# EAGLE design baseboard_v1 (EAGLE 9.5.1)
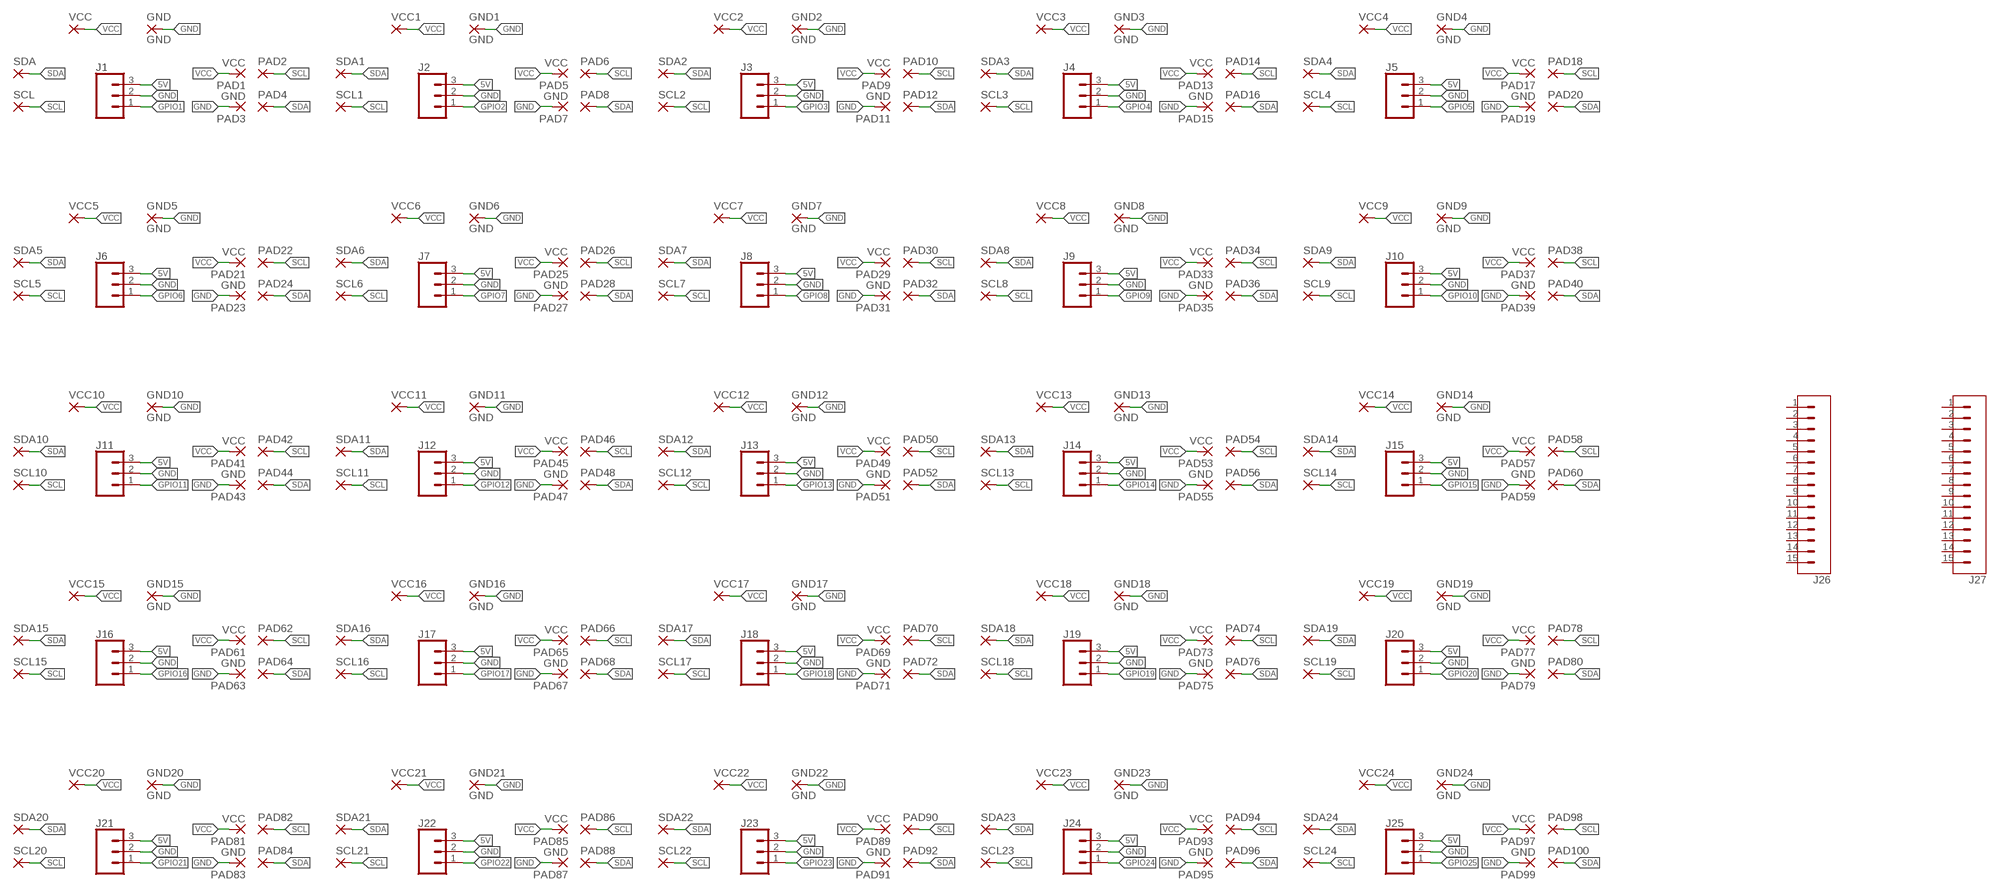
[diagram p0: schematic, sheet 1]

## Parts
GND  GND  2,15/1,0  [2,15/1,0]
GND1  GND  2,15/1,0  [2,15/1,0]
GND2  GND  2,15/1,0  [2,15/1,0]
GND3  GND  2,15/1,0  [2,15/1,0]
GND4  GND  2,15/1,0  [2,15/1,0]
GND5  GND  2,15/1,0  [2,15/1,0]
GND6  GND  2,15/1,0  [2,15/1,0]
GND7  GND  2,15/1,0  [2,15/1,0]
GND8  GND  2,15/1,0  [2,15/1,0]
GND9  GND  2,15/1,0  [2,15/1,0]
GND10  GND  2,15/1,0  [2,15/1,0]
GND11  GND  2,15/1,0  [2,15/1,0]
GND12  GND  2,15/1,0  [2,15/1,0]
GND13  GND  2,15/1,0  [2,15/1,0]
GND14  GND  2,15/1,0  [2,15/1,0]
GND15  GND  2,15/1,0  [2,15/1,0]
GND16  GND  2,15/1,0  [2,15/1,0]
GND17  GND  2,15/1,0  [2,15/1,0]
GND18  GND  2,15/1,0  [2,15/1,0]
GND19  GND  2,15/1,0  [2,15/1,0]
GND20  GND  2,15/1,0  [2,15/1,0]
GND21  GND  2,15/1,0  [2,15/1,0]
GND22  GND  2,15/1,0  [2,15/1,0]
GND23  GND  2,15/1,0  [2,15/1,0]
GND24  GND  2,15/1,0  [2,15/1,0]
J1  CONN_03  [1X03]
J2  CONN_03  [1X03]
J3  CONN_03  [1X03]
J4  CONN_03  [1X03]
J5  CONN_03  [1X03]
J6  CONN_03  [1X03]
J7  CONN_03  [1X03]
J8  CONN_03  [1X03]
J9  CONN_03  [1X03]
J10  CONN_03  [1X03]
J11  CONN_03  [1X03]
J12  CONN_03  [1X03]
J13  CONN_03  [1X03]
J14  CONN_03  [1X03]
J15  CONN_03  [1X03]
J16  CONN_03  [1X03]
J17  CONN_03  [1X03]
J18  CONN_03  [1X03]
J19  CONN_03  [1X03]
J20  CONN_03  [1X03]
J21  CONN_03  [1X03]
J22  CONN_03  [1X03]
J23  CONN_03  [1X03]
J24  CONN_03  [1X03]
J25  CONN_03  [1X03]
J26  CONN_06SMD_MALE  [1X15_SMD_MALE]
J27  CONN_06SMD_MALE  [1X15_SMD_MALE]
PAD1  VCC  2,15/1,0  [2,15/1,0]
PAD2  2,15/1,0  [2,15/1,0]
PAD3  GND  2,15/1,0  [2,15/1,0]
PAD4  2,15/1,0  [2,15/1,0]
PAD5  VCC  2,15/1,0  [2,15/1,0]
PAD6  2,15/1,0  [2,15/1,0]
PAD7  GND  2,15/1,0  [2,15/1,0]
PAD8  2,15/1,0  [2,15/1,0]
PAD9  VCC  2,15/1,0  [2,15/1,0]
PAD10  2,15/1,0  [2,15/1,0]
PAD11  GND  2,15/1,0  [2,15/1,0]
PAD12  2,15/1,0  [2,15/1,0]
PAD13  VCC  2,15/1,0  [2,15/1,0]
PAD14  2,15/1,0  [2,15/1,0]
PAD15  GND  2,15/1,0  [2,15/1,0]
PAD16  2,15/1,0  [2,15/1,0]
PAD17  VCC  2,15/1,0  [2,15/1,0]
PAD18  2,15/1,0  [2,15/1,0]
PAD19  GND  2,15/1,0  [2,15/1,0]
PAD20  2,15/1,0  [2,15/1,0]
PAD21  VCC  2,15/1,0  [2,15/1,0]
PAD22  2,15/1,0  [2,15/1,0]
PAD23  GND  2,15/1,0  [2,15/1,0]
PAD24  2,15/1,0  [2,15/1,0]
PAD25  VCC  2,15/1,0  [2,15/1,0]
PAD26  2,15/1,0  [2,15/1,0]
PAD27  GND  2,15/1,0  [2,15/1,0]
PAD28  2,15/1,0  [2,15/1,0]
PAD29  VCC  2,15/1,0  [2,15/1,0]
PAD30  2,15/1,0  [2,15/1,0]
PAD31  GND  2,15/1,0  [2,15/1,0]
PAD32  2,15/1,0  [2,15/1,0]
PAD33  VCC  2,15/1,0  [2,15/1,0]
PAD34  2,15/1,0  [2,15/1,0]
PAD35  GND  2,15/1,0  [2,15/1,0]
PAD36  2,15/1,0  [2,15/1,0]
PAD37  VCC  2,15/1,0  [2,15/1,0]
PAD38  2,15/1,0  [2,15/1,0]
PAD39  GND  2,15/1,0  [2,15/1,0]
PAD40  2,15/1,0  [2,15/1,0]
PAD41  VCC  2,15/1,0  [2,15/1,0]
PAD42  2,15/1,0  [2,15/1,0]
PAD43  GND  2,15/1,0  [2,15/1,0]
PAD44  2,15/1,0  [2,15/1,0]
PAD45  VCC  2,15/1,0  [2,15/1,0]
PAD46  2,15/1,0  [2,15/1,0]
PAD47  GND  2,15/1,0  [2,15/1,0]
PAD48  2,15/1,0  [2,15/1,0]
PAD49  VCC  2,15/1,0  [2,15/1,0]
PAD50  2,15/1,0  [2,15/1,0]
PAD51  GND  2,15/1,0  [2,15/1,0]
PAD52  2,15/1,0  [2,15/1,0]
PAD53  VCC  2,15/1,0  [2,15/1,0]
PAD54  2,15/1,0  [2,15/1,0]
PAD55  GND  2,15/1,0  [2,15/1,0]
PAD56  2,15/1,0  [2,15/1,0]
PAD57  VCC  2,15/1,0  [2,15/1,0]
PAD58  2,15/1,0  [2,15/1,0]
PAD59  GND  2,15/1,0  [2,15/1,0]
PAD60  2,15/1,0  [2,15/1,0]
PAD61  VCC  2,15/1,0  [2,15/1,0]
PAD62  2,15/1,0  [2,15/1,0]
PAD63  GND  2,15/1,0  [2,15/1,0]
PAD64  2,15/1,0  [2,15/1,0]
PAD65  VCC  2,15/1,0  [2,15/1,0]
PAD66  2,15/1,0  [2,15/1,0]
PAD67  GND  2,15/1,0  [2,15/1,0]
PAD68  2,15/1,0  [2,15/1,0]
PAD69  VCC  2,15/1,0  [2,15/1,0]
PAD70  2,15/1,0  [2,15/1,0]
PAD71  GND  2,15/1,0  [2,15/1,0]
PAD72  2,15/1,0  [2,15/1,0]
PAD73  VCC  2,15/1,0  [2,15/1,0]
PAD74  2,15/1,0  [2,15/1,0]
PAD75  GND  2,15/1,0  [2,15/1,0]
PAD76  2,15/1,0  [2,15/1,0]
PAD77  VCC  2,15/1,0  [2,15/1,0]
PAD78  2,15/1,0  [2,15/1,0]
PAD79  GND  2,15/1,0  [2,15/1,0]
PAD80  2,15/1,0  [2,15/1,0]
PAD81  VCC  2,15/1,0  [2,15/1,0]
PAD82  2,15/1,0  [2,15/1,0]
PAD83  GND  2,15/1,0  [2,15/1,0]
PAD84  2,15/1,0  [2,15/1,0]
PAD85  VCC  2,15/1,0  [2,15/1,0]
PAD86  2,15/1,0  [2,15/1,0]
PAD87  GND  2,15/1,0  [2,15/1,0]
PAD88  2,15/1,0  [2,15/1,0]
PAD89  VCC  2,15/1,0  [2,15/1,0]
PAD90  2,15/1,0  [2,15/1,0]
PAD91  GND  2,15/1,0  [2,15/1,0]
PAD92  2,15/1,0  [2,15/1,0]
PAD93  VCC  2,15/1,0  [2,15/1,0]
PAD94  2,15/1,0  [2,15/1,0]
PAD95  GND  2,15/1,0  [2,15/1,0]
PAD96  2,15/1,0  [2,15/1,0]
PAD97  VCC  2,15/1,0  [2,15/1,0]
PAD98  2,15/1,0  [2,15/1,0]
PAD99  GND  2,15/1,0  [2,15/1,0]
PAD100  2,15/1,0  [2,15/1,0]
SCL  2,15/1,0  [2,15/1,0]
SCL1  2,15/1,0  [2,15/1,0]
SCL2  2,15/1,0  [2,15/1,0]
SCL3  2,15/1,0  [2,15/1,0]
SCL4  2,15/1,0  [2,15/1,0]
SCL5  2,15/1,0  [2,15/1,0]
SCL6  2,15/1,0  [2,15/1,0]
SCL7  2,15/1,0  [2,15/1,0]
SCL8  2,15/1,0  [2,15/1,0]
SCL9  2,15/1,0  [2,15/1,0]
SCL10  2,15/1,0  [2,15/1,0]
SCL11  2,15/1,0  [2,15/1,0]
SCL12  2,15/1,0  [2,15/1,0]
SCL13  2,15/1,0  [2,15/1,0]
SCL14  2,15/1,0  [2,15/1,0]
SCL15  2,15/1,0  [2,15/1,0]
SCL16  2,15/1,0  [2,15/1,0]
SCL17  2,15/1,0  [2,15/1,0]
SCL18  2,15/1,0  [2,15/1,0]
SCL19  2,15/1,0  [2,15/1,0]
SCL20  2,15/1,0  [2,15/1,0]
SCL21  2,15/1,0  [2,15/1,0]
SCL22  2,15/1,0  [2,15/1,0]
SCL23  2,15/1,0  [2,15/1,0]
SCL24  2,15/1,0  [2,15/1,0]
SDA  2,15/1,0  [2,15/1,0]
SDA1  2,15/1,0  [2,15/1,0]
SDA2  2,15/1,0  [2,15/1,0]
SDA3  2,15/1,0  [2,15/1,0]
SDA4  2,15/1,0  [2,15/1,0]
SDA5  2,15/1,0  [2,15/1,0]
SDA6  2,15/1,0  [2,15/1,0]
SDA7  2,15/1,0  [2,15/1,0]
SDA8  2,15/1,0  [2,15/1,0]
SDA9  2,15/1,0  [2,15/1,0]
SDA10  2,15/1,0  [2,15/1,0]
SDA11  2,15/1,0  [2,15/1,0]
SDA12  2,15/1,0  [2,15/1,0]
SDA13  2,15/1,0  [2,15/1,0]
SDA14  2,15/1,0  [2,15/1,0]
SDA15  2,15/1,0  [2,15/1,0]
SDA16  2,15/1,0  [2,15/1,0]
SDA17  2,15/1,0  [2,15/1,0]
SDA18  2,15/1,0  [2,15/1,0]
SDA19  2,15/1,0  [2,15/1,0]
SDA20  2,15/1,0  [2,15/1,0]
SDA21  2,15/1,0  [2,15/1,0]
SDA22  2,15/1,0  [2,15/1,0]
SDA23  2,15/1,0  [2,15/1,0]
SDA24  2,15/1,0  [2,15/1,0]
VCC  2,15/1,0  [2,15/1,0]
VCC1  2,15/1,0  [2,15/1,0]
VCC2  2,15/1,0  [2,15/1,0]
VCC3  2,15/1,0  [2,15/1,0]
VCC4  2,15/1,0  [2,15/1,0]
VCC5  2,15/1,0  [2,15/1,0]
VCC6  2,15/1,0  [2,15/1,0]
VCC7  2,15/1,0  [2,15/1,0]
VCC8  2,15/1,0  [2,15/1,0]
VCC9  2,15/1,0  [2,15/1,0]
VCC10  2,15/1,0  [2,15/1,0]
VCC11  2,15/1,0  [2,15/1,0]
VCC12  2,15/1,0  [2,15/1,0]
VCC13  2,15/1,0  [2,15/1,0]
VCC14  2,15/1,0  [2,15/1,0]
VCC15  2,15/1,0  [2,15/1,0]
VCC16  2,15/1,0  [2,15/1,0]
VCC17  2,15/1,0  [2,15/1,0]
VCC18  2,15/1,0  [2,15/1,0]
VCC19  2,15/1,0  [2,15/1,0]
VCC20  2,15/1,0  [2,15/1,0]
VCC21  2,15/1,0  [2,15/1,0]
VCC22  2,15/1,0  [2,15/1,0]
VCC23  2,15/1,0  [2,15/1,0]
VCC24  2,15/1,0  [2,15/1,0]

## Nets
5V: J1.3 J2.3 J3.3 J4.3 J5.3 J6.3 J7.3 J8.3 J9.3 J10.3 J11.3 J12.3 J13.3 J14.3 J15.3 J16.3 J17.3 J18.3 J19.3 J20.3 J21.3 J22.3 J23.3 J24.3 J25.3
GND: GND1.1(P) GND2.1(P) GND3.1(P) GND4.1(P) GND5.1(P) GND6.1(P) GND7.1(P) GND8.1(P) GND9.1(P) GND10.1(P) GND11.1(P) GND12.1(P) GND13.1(P) GND14.1(P) GND15.1(P) GND16.1(P) GND17.1(P) GND18.1(P) GND19.1(P) GND20.1(P) GND21.1(P) GND22.1(P) GND23.1(P) GND24.1(P) GND.1(P) J1.2 J2.2 J3.2 J4.2 J5.2 J6.2 J7.2 J8.2 J9.2 J10.2 J11.2 J12.2 J13.2 J14.2 J15.2 J16.2 J17.2 J18.2 J19.2 J20.2 J21.2 J22.2 J23.2 J24.2 J25.2 PAD3.1(P) PAD7.1(P) PAD11.1(P) PAD15.1(P) PAD19.1(P) PAD23.1(P) PAD27.1(P) PAD31.1(P) PAD35.1(P) PAD39.1(P) PAD43.1(P) PAD47.1(P) PAD51.1(P) PAD55.1(P) PAD59.1(P) PAD63.1(P) PAD67.1(P) PAD71.1(P) PAD75.1(P) PAD79.1(P) PAD83.1(P) PAD87.1(P) PAD91.1(P) PAD95.1(P) PAD99.1(P)
GPIO1: J1.1
GPIO2: J2.1
GPIO3: J3.1
GPIO4: J4.1
GPIO5: J5.1
GPIO6: J6.1
GPIO7: J7.1
GPIO8: J8.1
GPIO9: J9.1
GPIO10: J10.1
GPIO11: J11.1
GPIO12: J12.1
GPIO13: J13.1
GPIO14: J14.1
GPIO15: J15.1
GPIO16: J16.1
GPIO17: J17.1
GPIO18: J18.1
GPIO19: J19.1
GPIO20: J20.1
GPIO21: J21.1
GPIO22: J22.1
GPIO23: J23.1
GPIO24: J24.1
GPIO25: J25.1
SCL: PAD2.1(P) PAD6.1(P) PAD10.1(P) PAD14.1(P) PAD18.1(P) PAD22.1(P) PAD26.1(P) PAD30.1(P) PAD34.1(P) PAD38.1(P) PAD42.1(P) PAD46.1(P) PAD50.1(P) PAD54.1(P) PAD58.1(P) PAD62.1(P) PAD66.1(P) PAD70.1(P) PAD74.1(P) PAD78.1(P) PAD82.1(P) PAD86.1(P) PAD90.1(P) PAD94.1(P) PAD98.1(P) SCL1.1(P) SCL2.1(P) SCL3.1(P) SCL4.1(P) SCL5.1(P) SCL6.1(P) SCL7.1(P) SCL8.1(P) SCL9.1(P) SCL10.1(P) SCL11.1(P) SCL12.1(P) SCL13.1(P) SCL14.1(P) SCL15.1(P) SCL16.1(P) SCL17.1(P) SCL18.1(P) SCL19.1(P) SCL20.1(P) SCL21.1(P) SCL22.1(P) SCL23.1(P) SCL24.1(P) SCL.1(P)
SDA: PAD4.1(P) PAD8.1(P) PAD12.1(P) PAD16.1(P) PAD20.1(P) PAD24.1(P) PAD28.1(P) PAD32.1(P) PAD36.1(P) PAD40.1(P) PAD44.1(P) PAD48.1(P) PAD52.1(P) PAD56.1(P) PAD60.1(P) PAD64.1(P) PAD68.1(P) PAD72.1(P) PAD76.1(P) PAD80.1(P) PAD84.1(P) PAD88.1(P) PAD92.1(P) PAD96.1(P) PAD100.1(P) SDA1.1(P) SDA2.1(P) SDA3.1(P) SDA4.1(P) SDA5.1(P) SDA6.1(P) SDA7.1(P) SDA8.1(P) SDA9.1(P) SDA10.1(P) SDA11.1(P) SDA12.1(P) SDA13.1(P) SDA14.1(P) SDA15.1(P) SDA16.1(P) SDA17.1(P) SDA18.1(P) SDA19.1(P) SDA20.1(P) SDA21.1(P) SDA22.1(P) SDA23.1(P) SDA24.1(P) SDA.1(P)
VCC: PAD1.1(P) PAD5.1(P) PAD9.1(P) PAD13.1(P) PAD17.1(P) PAD21.1(P) PAD25.1(P) PAD29.1(P) PAD33.1(P) PAD37.1(P) PAD41.1(P) PAD45.1(P) PAD49.1(P) PAD53.1(P) PAD57.1(P) PAD61.1(P) PAD65.1(P) PAD69.1(P) PAD73.1(P) PAD77.1(P) PAD81.1(P) PAD85.1(P) PAD89.1(P) PAD93.1(P) PAD97.1(P) VCC1.1(P) VCC2.1(P) VCC3.1(P) VCC4.1(P) VCC5.1(P) VCC6.1(P) VCC7.1(P) VCC8.1(P) VCC9.1(P) VCC10.1(P) VCC11.1(P) VCC12.1(P) VCC13.1(P) VCC14.1(P) VCC15.1(P) VCC16.1(P) VCC17.1(P) VCC18.1(P) VCC19.1(P) VCC20.1(P) VCC21.1(P) VCC22.1(P) VCC23.1(P) VCC24.1(P) VCC.1(P)
Unconnected: J26.1 J26.2 J26.3 J26.4 J26.5 J26.6 J26.7 J26.8 J26.9 J26.10 J26.11 J26.12 J26.13 J26.14 J26.15 J27.1 J27.2 J27.3 J27.4 J27.5 J27.6 J27.7 J27.8 J27.9 J27.10 J27.11 J27.12 J27.13 J27.14 J27.15

## Library data of the parts
GND GND1-GND24 PAD1-PAD100 SCL SCL1-SCL24 SDA SDA1-SDA24 VCC VCC1-VCC24 = wirepad:2,15/1,0: THROUGH-HOLE PAD
J1-J25 = SparkFun-Connectors:CONN_03: Multi connection point. Often used as Generic Header-pin footprint for 0.1 inch spaced/style header connections On any of the 0.1 inch spaced packages, you can populate with these: Break Away Headers - Straight <https://www.sparkfun.com/products/116> (PRT-00116) Break Away Male Headers - Right Angle <https://www.sparkfun.com/products/553> (PRT-00553) Female Headers <https://www.sparkfun.com/products/115> (PRT-00115) Break Away Headers - Machine Pin <https://www.sparkfun.com/products/117> (PRT-00117) Break Away Female Headers - Swiss Machine Pin <https://www.sparkfun.com/products/743> (PRT-00743) Stackable Header - 3 Pin (Female, 0.1") <https://www.sparkfun.com/products/13875> (PRT-13875) For SCREWTERMINALS and SPRING TERMINALS visit here: Screw Terimnals on SparkFun.com <https://www.sparkfun.com/search/results?term=Screw+Terminals> (5mm/3.5mm/2.54mm spacing) This device is also useful as a general connection point to wire up your design to another part of your project. Our various solder wires solder well into these plated through hole pads. Hook-Up Wire - Assortment (Stranded, 22 AWG) <https://www.sparkfun.com/products/11375> (PRT-11375) Hook-Up Wire - Assortment (Solid Core, 22 AWG) <https://www.sparkfun.com/products/11367> (PRT-11367) View the entire wire category on our website here <https://www.sparkfun.com/categories/141> Special notes: Molex polarized connector foot print use with SKU : PRT-08232 with associated crimp pins and housings.
J26 J27 = capstone footprints:CONN_06: Multi connection point. Often used as Generic Header-pin footprint for 0.1 inch spaced/style header connections On any of the 0.1 inch spaced packages, you can populate with these: Break Away Headers - Straight <https://www.sparkfun.com/products/116> (PRT-00116) Break Away Male Headers - Right Angle <https://www.sparkfun.com/products/553> (PRT-00553) Female Headers <https://www.sparkfun.com/products/115> (PRT-00115) Break Away Headers - Machine Pin <https://www.sparkfun.com/products/117> (PRT-00117) Break Away Female Headers - Swiss Machine Pin <https://www.sparkfun.com/products/743> (PRT-00743) Arduino Stackable Header - 6 Pin <https://www.sparkfun.com/products/9280> (PRT-09280) For SCREWTERMINALS and SPRING TERMINALS visit here: Screw Terimnals on SparkFun.com <https://www.sparkfun.com/search/results?term=Screw+Terminals> (5mm/3.5mm/2.54mm spacing) This device is also useful as a general connection point to wire up your design to another part of your project. Our various solder wires solder well into these plated through hole pads. Hook-Up Wire - Assortment (Stranded, 22 AWG) <https://www.sparkfun.com/products/11375> (PRT-11375) Hook-Up Wire - Assortment (Solid Core, 22 AWG) <https://www.sparkfun.com/products/11367> (PRT-11367) View the entire wire category on our website here <https://www.sparkfun.com/categories/141>; PROD_ID: CONN-11293

## Board
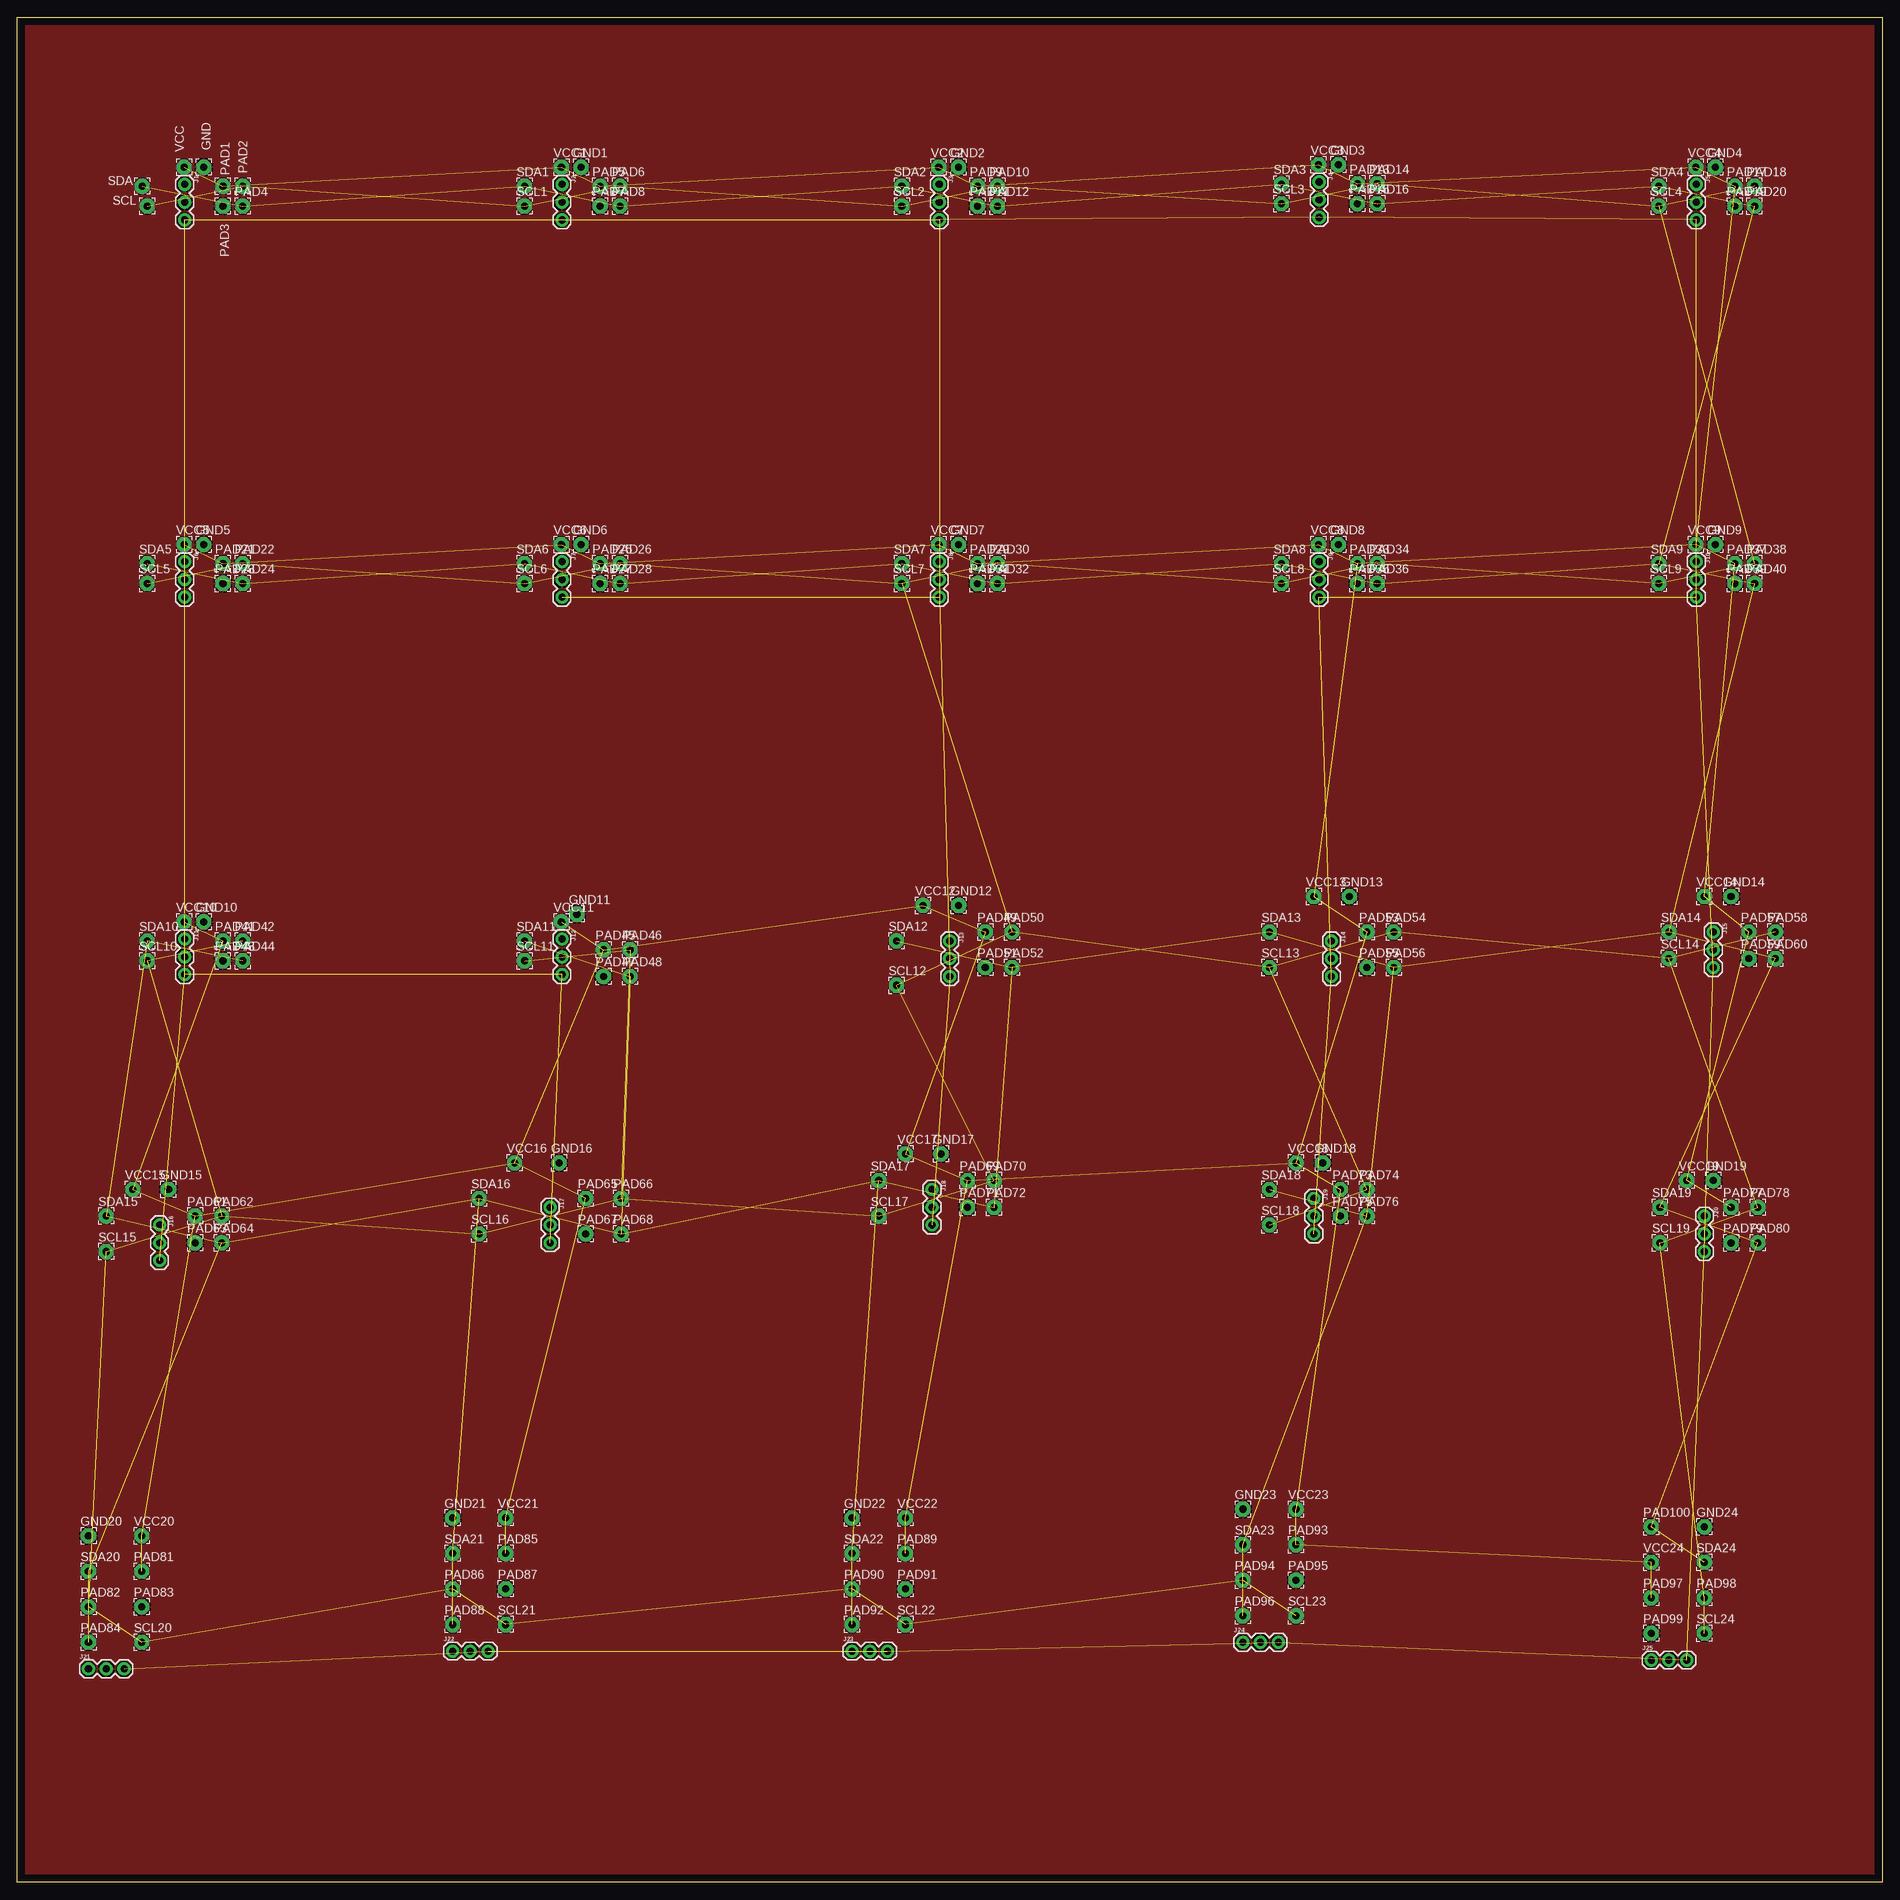
[diagram p1: board, top side]
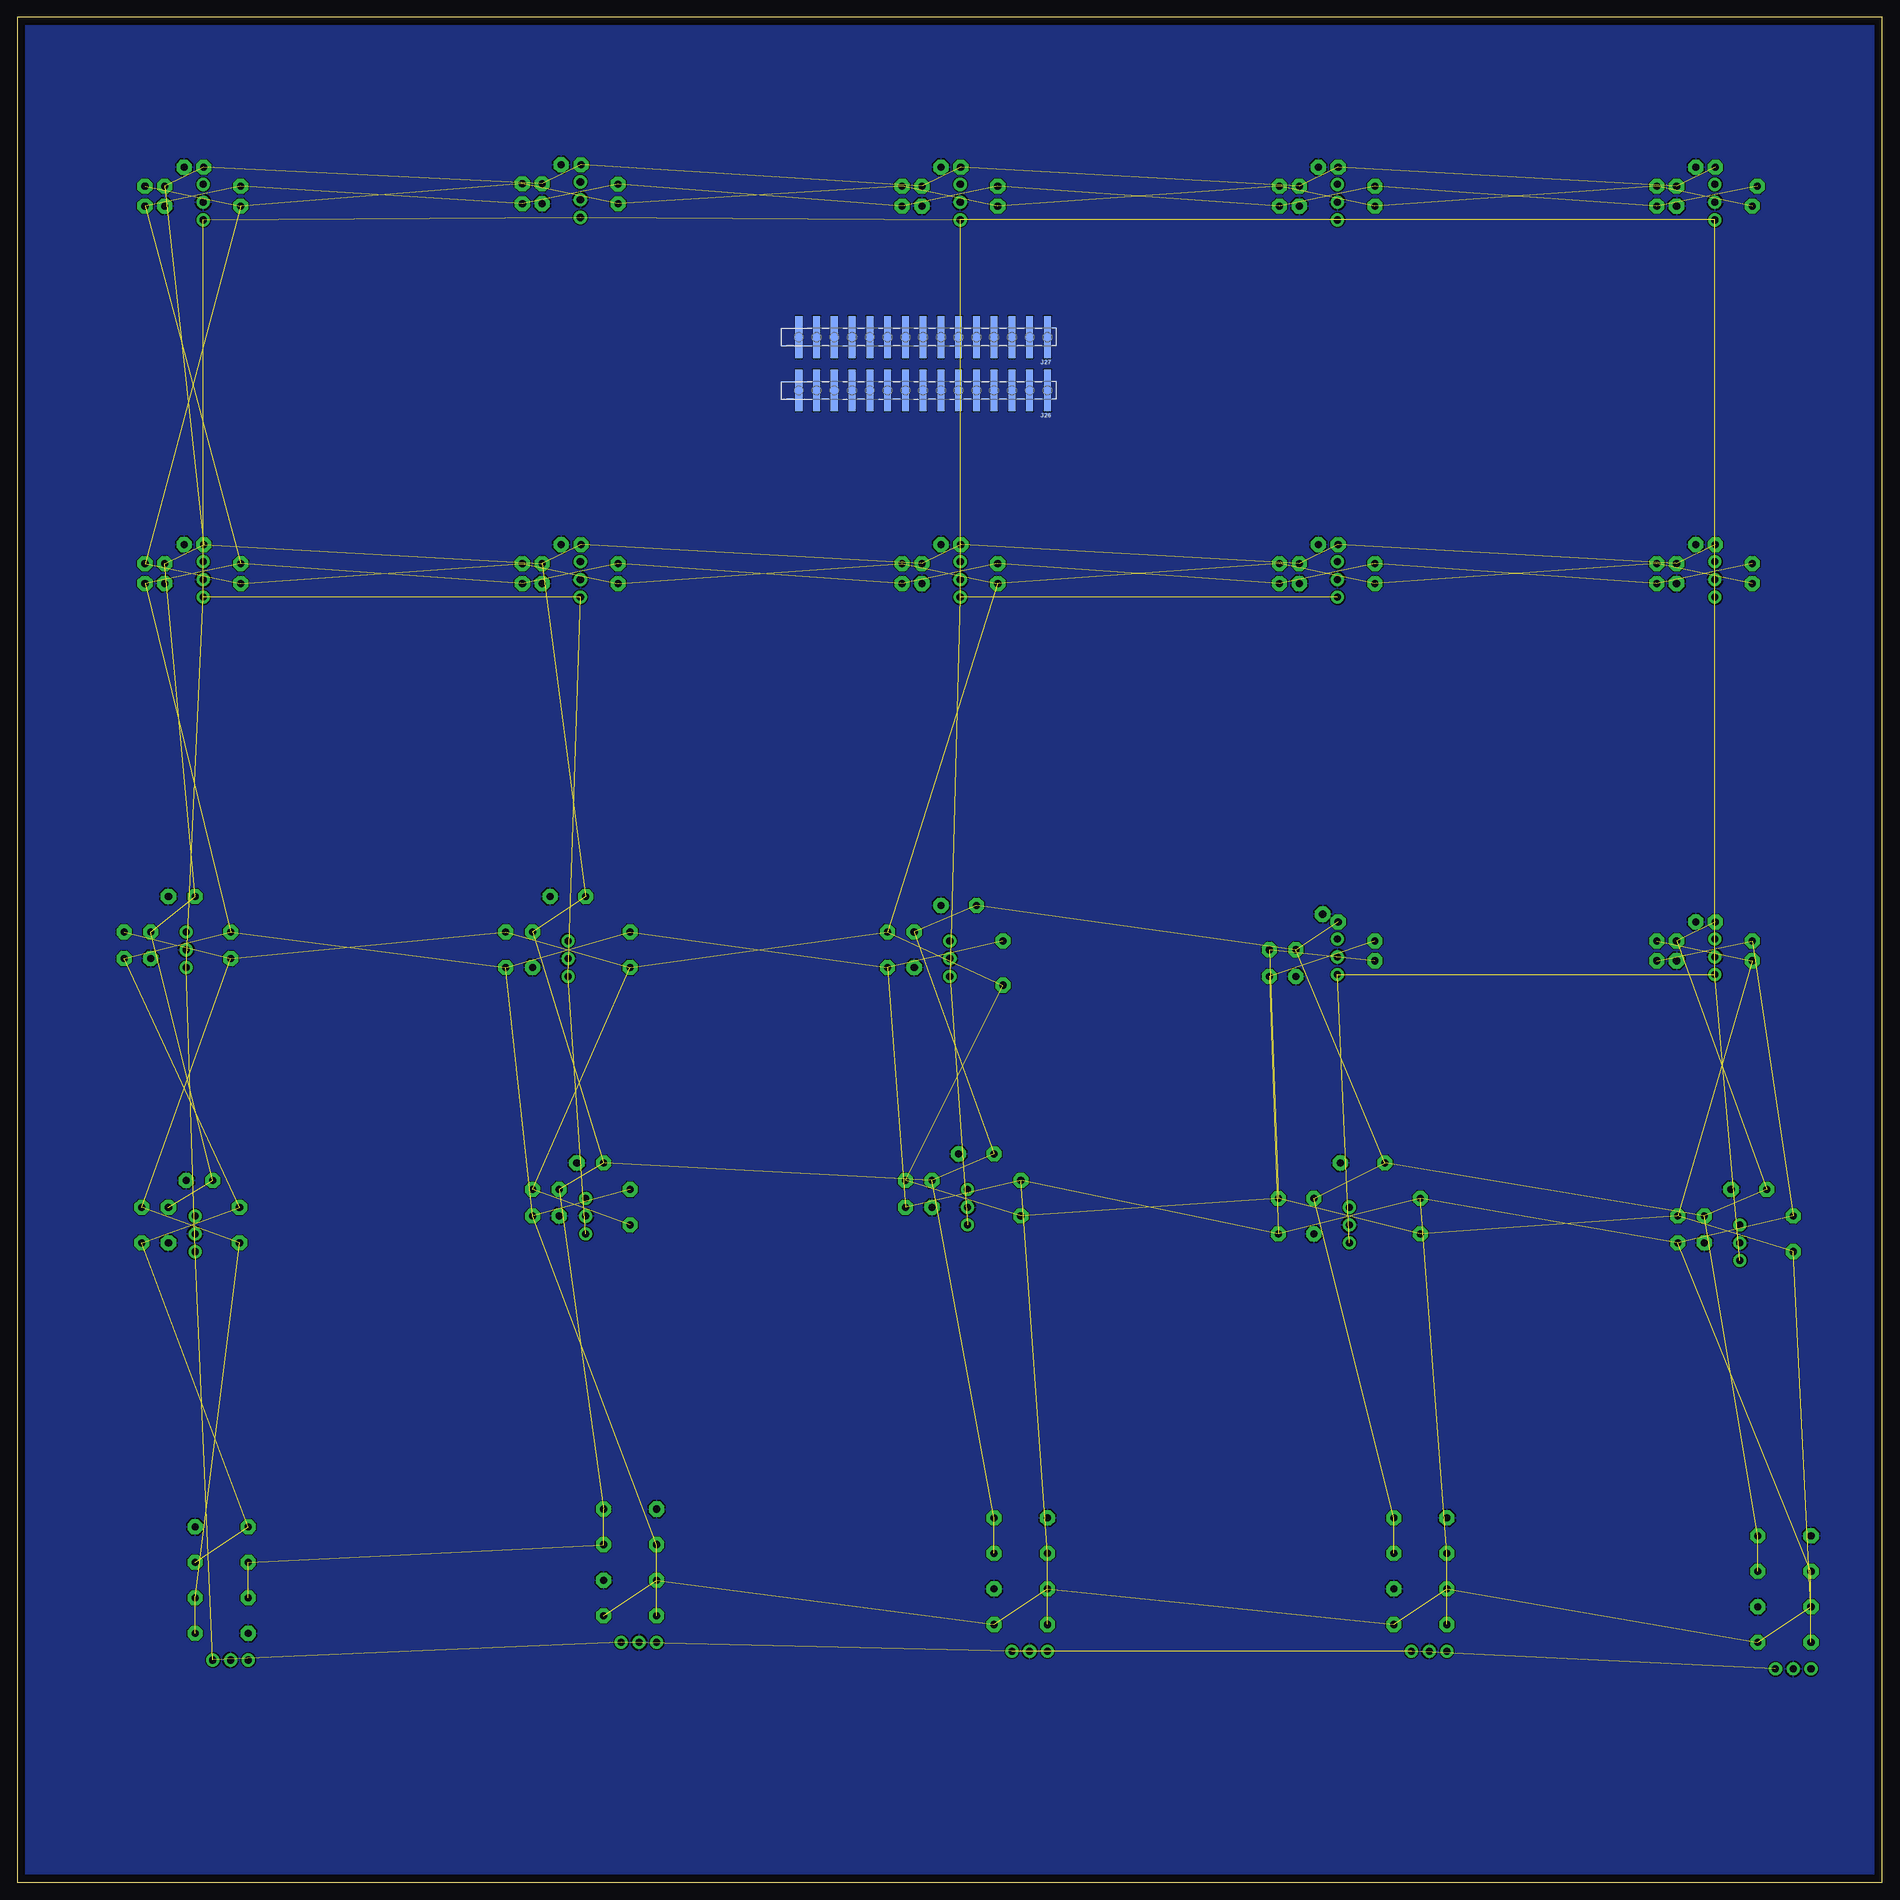
[diagram p2: board, bottom side, seen from below]

Size 266.7 x 266.7 mm. Coordinates in mm from the lower left corner, seen from the top.
Outline: 0,0 0,266.7 266.7,266.7 266.7,0 0,0
Copper layers (1*16): Top 0.035mm / dielectric 1.5mm / Bottom 0.035mm
Design rules "default": minimum track width 6mil, minimum drill 0.35mm, track to track 6mil, track to pad 6mil, pad to pad 6mil, via to via 6mil, smd to smd 6mil, copper to edge 40mil, drill to drill 6mil, minimum pad ring 10mil, minimum via ring 8mil, stop-mask expansion 4mil, vias tented up to drill 0mil, thermal gap 10mil

### Footprints (pad centres in the part's own frame; a part is rotated, then mirrored left to right if it is on the bottom)
2,15/1,0 = drill 1.016 pad 2.159 octagon: 1 0,0
1X03 = drill 1.016 pad 1.88: 1 0,0; 2 2.54,0; 3 5.08,0
1X15_SMD_MALE = smd 1.02 x 6: 1 0,0; 2 2.54,0; 3 5.08,0; 4 7.62,0; 5 10.16,0; 6 12.7,0; 7 15.24,0; 8 17.78,0; 9 20.32,0; 10 22.86,0; 11 25.4,0; 12 27.94,0; 13 30.48,0; 14 33.02,0; 15 35.56,0

### Placement (x,y rotation side)
GND  26.64,245.26 0 top
GND1  80.62,245.26 0 top
GND2  134.59,245.26 0 top
GND3  188.93,245.62 0 top
GND4  242.87,245.26 0 top
GND5  26.64,191.31 0 top
GND6  80.62,191.31 0 top
GND7  134.59,191.31 0 top
GND8  188.93,191.31 0 top
GND9  242.87,191.31 0 top
GND10  26.64,137.34 0 top
GND11  80.01,138.43 0 top
GND12  134.62,139.7 0 top
GND13  190.5,140.97 0 top
GND14  245.11,140.97 0 top
GND15  21.59,99.06 0 top
GND16  77.47,102.87 0 top
GND17  132.08,104.14 0 top
GND18  186.69,102.87 0 top
GND19  242.57,100.33 0 top
GND20  10.16,49.53 0 top
GND21  62.23,52.07 0 top
GND22  119.38,52.07 0 top
GND23  175.26,53.34 0 top
GND24  241.3,50.8 0 top
J1  23.9,242.82 270 top
J2  77.88,242.82 270 top
J3  131.85,242.82 270 top
J4  186.18,243.18 270 top
J5  240.13,242.82 270 top
J6  23.9,188.85 270 top
J7  77.88,188.85 270 top
J8  131.85,188.85 270 top
J9  186.18,188.85 270 top
J10  240.13,188.85 270 top
J11  23.9,134.87 270 top
J12  77.88,134.87 270 top
J13  133.35,134.62 270 top
J14  187.96,134.62 270 top
J15  242.57,135.89 270 top
J16  20.32,93.98 270 top
J17  76.2,96.52 270 top
J18  130.81,99.06 270 top
J19  185.42,97.79 270 top
J20  241.3,95.25 270 top
J21  10.16,30.48 0 top
J22  62.23,33.02 0 top
J23  119.38,33.02 0 top
J24  175.26,34.29 0 top
J25  233.68,31.75 0 top
J26  119.38,213.36 180 bottom
J27  119.38,220.98 180 bottom
PAD1  29.39,242.54 0 top
PAD2  32.21,242.54 0 top
PAD3  29.39,239.73 0 top
PAD4  32.21,239.73 0 top
PAD5  83.36,242.54 0 top
PAD6  86.18,242.54 0 top
PAD7  83.36,239.73 0 top
PAD8  86.18,239.73 0 top
PAD9  137.34,242.54 0 top
PAD10  140.16,242.54 0 top
PAD11  137.34,239.73 0 top
PAD12  140.16,239.73 0 top
PAD13  191.67,242.9 0 top
PAD14  194.49,242.9 0 top
PAD15  191.67,240.06 0 top
PAD16  194.49,240.06 0 top
PAD17  245.64,242.54 0 top
PAD18  248.46,242.54 0 top
PAD19  245.64,239.73 0 top
PAD20  248.46,239.73 0 top
PAD21  29.39,188.57 0 top
PAD22  32.21,188.57 0 top
PAD23  29.39,185.75 0 top
PAD24  32.21,185.75 0 top
PAD25  83.36,188.57 0 top
PAD26  86.18,188.57 0 top
PAD27  83.36,185.75 0 top
PAD28  86.18,185.75 0 top
PAD29  137.34,188.57 0 top
PAD30  140.16,188.57 0 top
PAD31  137.34,185.75 0 top
PAD32  140.16,185.75 0 top
PAD33  191.67,188.57 0 top
PAD34  194.49,188.57 0 top
PAD35  191.67,185.75 0 top
PAD36  194.49,185.75 0 top
PAD37  245.64,188.57 0 top
PAD38  248.46,188.57 0 top
PAD39  245.64,185.75 0 top
PAD40  248.46,185.75 0 top
PAD41  29.39,134.59 0 top
PAD42  32.21,134.59 0 top
PAD43  29.39,131.78 0 top
PAD44  32.21,131.78 0 top
PAD45  83.82,133.35 0 top
PAD46  87.63,133.35 0 top
PAD47  83.82,129.54 0 top
PAD48  87.63,129.54 0 top
PAD49  138.43,135.89 0 top
PAD50  142.24,135.89 0 top
PAD51  138.43,130.81 0 top
PAD52  142.24,130.81 0 top
PAD53  193.04,135.89 0 top
PAD54  196.85,135.89 0 top
PAD55  193.04,130.81 0 top
PAD56  196.85,130.81 0 top
PAD57  247.65,135.89 0 top
PAD58  251.46,135.89 0 top
PAD59  247.65,132.08 0 top
PAD60  251.46,132.08 0 top
PAD61  25.4,95.25 0 top
PAD62  29.21,95.25 0 top
PAD63  25.4,91.44 0 top
PAD64  29.21,91.44 0 top
PAD65  81.28,97.79 0 top
PAD66  86.36,97.79 0 top
PAD67  81.28,92.71 0 top
PAD68  86.36,92.71 0 top
PAD69  135.89,100.33 0 top
PAD70  139.7,100.33 0 top
PAD71  135.89,96.52 0 top
PAD72  139.7,96.52 0 top
PAD73  189.23,99.06 0 top
PAD74  193.04,99.06 0 top
PAD75  189.23,95.25 0 top
PAD76  193.04,95.25 0 top
PAD77  245.11,96.52 0 top
PAD78  248.92,96.52 0 top
PAD79  245.11,91.44 0 top
PAD80  248.92,91.44 0 top
PAD81  17.78,44.45 0 top
PAD82  10.16,39.37 0 top
PAD83  17.78,39.37 0 top
PAD84  10.16,34.29 0 top
PAD85  69.85,46.99 0 top
PAD86  62.23,41.91 0 top
PAD87  69.85,41.91 0 top
PAD88  62.23,36.83 0 top
PAD89  127,46.99 0 top
PAD90  119.38,41.91 0 top
PAD91  127,41.91 0 top
PAD92  119.38,36.83 0 top
PAD93  182.88,48.26 0 top
PAD94  175.26,43.18 0 top
PAD95  182.88,43.18 0 top
PAD96  175.26,38.1 0 top
PAD97  233.68,40.64 0 top
PAD98  241.3,40.64 0 top
PAD99  233.68,35.56 0 top
PAD100  233.68,50.8 0 top
SCL  18.54,239.73 0 top
SCL1  72.52,239.73 0 top
SCL2  126.49,239.73 0 top
SCL3  180.8,240.06 0 top
SCL4  234.77,239.73 0 top
SCL5  18.54,185.75 0 top
SCL6  72.52,185.75 0 top
SCL7  126.49,185.75 0 top
SCL8  180.8,185.75 0 top
SCL9  234.77,185.75 0 top
SCL10  18.54,131.78 0 top
SCL11  72.52,131.78 0 top
SCL12  125.73,128.27 0 top
SCL13  179.07,130.81 0 top
SCL14  236.22,132.08 0 top
SCL15  12.7,90.17 0 top
SCL16  66.04,92.71 0 top
SCL17  123.19,95.25 0 top
SCL18  179.07,93.98 0 top
SCL19  234.95,91.44 0 top
SCL20  17.78,34.29 0 top
SCL21  69.85,36.83 0 top
SCL22  127,36.83 0 top
SCL23  182.88,38.1 0 top
SCL24  241.3,35.56 0 top
SDA  17.86,242.54 0 top
SDA1  72.52,242.54 0 top
SDA2  126.49,242.54 0 top
SDA3  180.8,242.87 0 top
SDA4  234.77,242.54 0 top
SDA5  18.54,188.57 0 top
SDA6  72.52,188.57 0 top
SDA7  126.49,188.57 0 top
SDA8  180.8,188.57 0 top
SDA9  234.77,188.57 0 top
SDA10  18.54,134.59 0 top
SDA11  72.52,134.59 0 top
SDA12  125.73,134.62 0 top
SDA13  179.07,135.89 0 top
SDA14  236.22,135.89 0 top
SDA15  12.7,95.25 0 top
SDA16  66.04,97.79 0 top
SDA17  123.19,100.33 0 top
SDA18  179.07,99.06 0 top
SDA19  234.95,96.52 0 top
SDA20  10.16,44.45 0 top
SDA21  62.23,46.99 0 top
SDA22  119.38,46.99 0 top
SDA23  175.26,48.26 0 top
SDA24  241.3,45.72 0 top
VCC  23.83,245.26 0 top
VCC1  77.8,245.26 0 top
VCC2  131.78,245.26 0 top
VCC3  186.11,245.62 0 top
VCC4  240.06,245.26 0 top
VCC5  23.83,191.31 0 top
VCC6  77.8,191.31 0 top
VCC7  131.78,191.31 0 top
VCC8  186.11,191.31 0 top
VCC9  240.06,191.31 0 top
VCC10  23.83,137.34 0 top
VCC11  77.8,137.34 0 top
VCC12  129.54,139.7 0 top
VCC13  185.42,140.97 0 top
VCC14  241.3,140.97 0 top
VCC15  16.51,99.06 0 top
VCC16  71.12,102.87 0 top
VCC17  127,104.14 0 top
VCC18  182.88,102.87 0 top
VCC19  238.76,100.33 0 top
VCC20  17.78,49.53 0 top
VCC21  69.85,52.07 0 top
VCC22  127,52.07 0 top
VCC23  182.88,53.34 0 top
VCC24  233.68,45.72 0 top

### Tracks (layer width: path | path; a pad name or v marks a point on that pad's centre or on a via)
5V  (24 unrouted)
GND
  pour Top: 0,266.7 266.7,266.7 266.7,0 0,0
  pour Bottom: 0,266.7 266.7,266.7 266.7,0 0,0
SCL  (49 unrouted)
SDA  (49 unrouted)
VCC  (49 unrouted)